# EAGLE schematic Mixer-v1 (EAGLE 6.6.0)

## Sheet 1 of 2
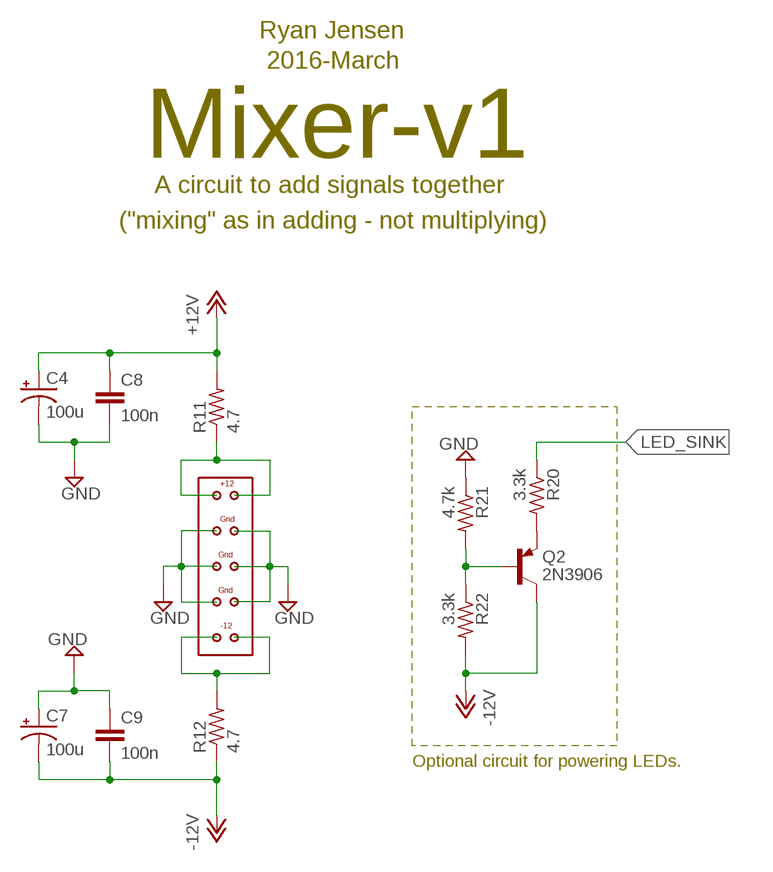
[diagram p0: schematic, sheet 1]

### Parts
C4  100u  CPOL-USE2.5-7  [E2,5-7]
C7  100u  CPOL-USE2.5-7  [E2,5-7]
C8  100n  C-EUC0603  [C0603]
C9  100n  C-EUC0603  [C0603]
Q2  2N3906  [TO92]
R11  4.7  R-US_R0603  [R0603]
R12  4.7  R-US_R0603  [R0603]
R20  3.3k  R-US_R0603  [R0603]
R21  4.7k  R-US_R0603  [R0603]
R22  3.3k  R-US_R0603  [R0603]
U$3  EURORACK-POWER  [EURORACK-POWER]

### Nets
+12V: C4.+ C8.1 R11.2 ; also sheet 2
-12V: C7.- C9.2 Q2.1(C) R12.1 R22.2 ; also sheet 2
GND: C4.- C7.+ C8.2 C9.1 R21.1 U$3.P$3 U$3.P$4 U$3.P$5 U$3.P$6 U$3.P$7 U$3.P$8 ; also sheet 2
LED_SINK: R20.1
N$2: R12.2 U$3.P$9 U$3.P$10
N$5: R11.1 U$3.P$1 U$3.P$2
N$13: Q2.3(E) R20.2
N$15: Q2.2(B) R21.2 R22.1

### Notes on the sheet
- Ryan Jensen
- 2016-March
- Mixer-v1
- A circuit to add signals together
- ("mixing" as in adding - not multiplying)
- Optional circuit for powering LEDs.

## Sheet 2 of 2
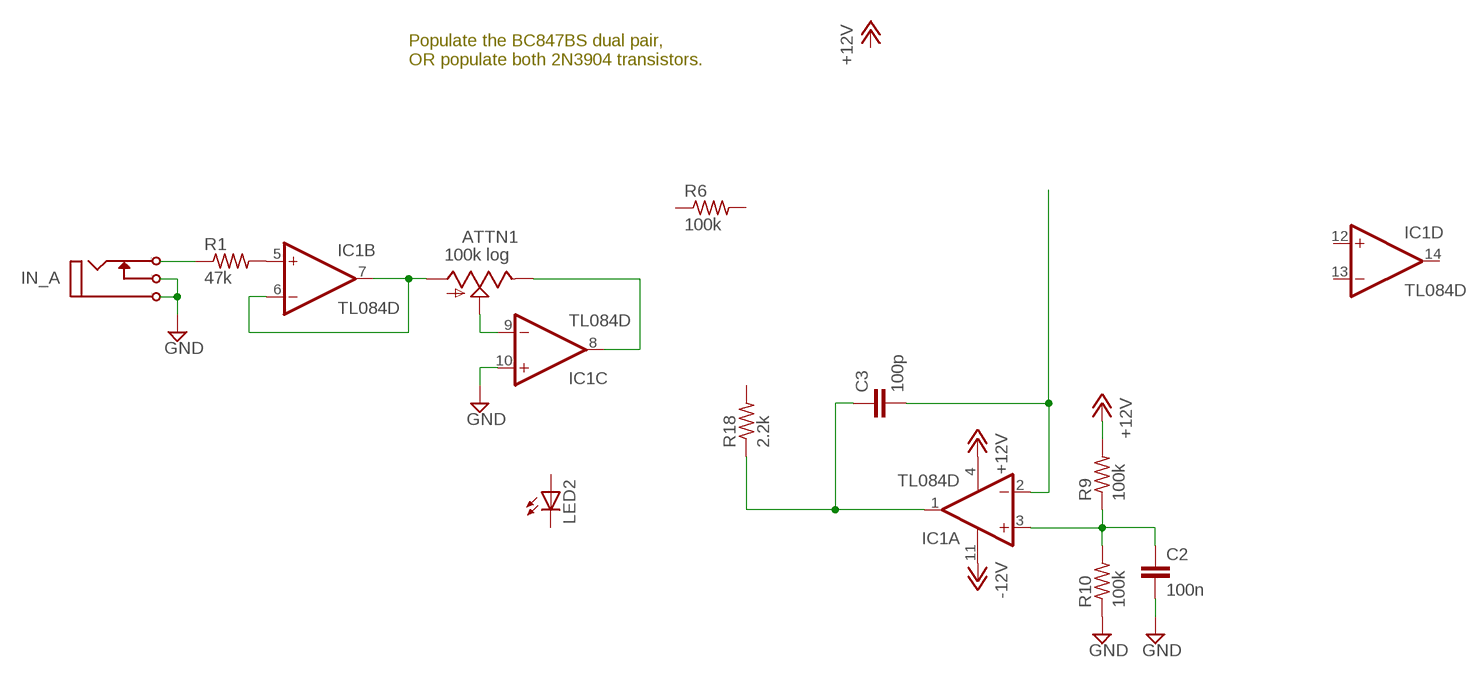
[diagram p1: schematic, sheet 2]

### Parts
ATTN1  100k log  TRIM_US-B64Y  [B64Y]
C2  100n  C-EUC0603  [C0603]
C3  100p  C-EUC0603  [C0603]
IC1  TL084D  [SO14]
IN_A  CV  MONO_JACK  [MONO_JACK]
LED2  LED_ELD260  [LED_LD260]
R1  47k  R-US_R0603  [R0603]
R6  100k  R-US_R0603  [R0603]
R9  100k  R-US_R0603  [R0603]
R10  100k  R-US_R0603  [R0603]
R18  2.2k  R-US_R0603  [R0603]

### Nets
+12V: IC1.4(P:V+) R9.2 ; also sheet 1
-12V: IC1.11(P:V-) ; also sheet 1
GND: C2.2 IC1.10(C:+IN) IN_A.P$1 IN_A.P$3(P3) R10.1 ; also sheet 1
IN_: IN_A.P$2(P2) R1.1
N$1: IC1.5(B:+IN) R1.2
N$3: ATTN1.A IC1.6(B:-IN) IC1.7(B:OUT)
N$4: ATTN1.S IC1.9(C:-IN)
N$6: C2.1 IC1.3(A:+IN) R9.1 R10.2
N$8: ATTN1.E IC1.8(C:OUT)
N$21: C3.1 IC1.1(A:OUT) R18.1
N$22: C3.2 IC1.2(A:-IN)
Unconnected: IC1.12(D:+IN) IC1.13(D:-IN) IC1.14(D:OUT) LED2.A LED2.K(C) R6.1 R6.2 R18.2

### Notes on the sheet
- Populate the BC847BS dual pair,
  OR populate both 2N3904 transistors.

## Library data of the parts
ATTN1 = pot:TRIM_US-: POTENTIOMETER
C2 C3 C8 C9 = rcl:C-EU: CAPACITOR, European symbol
C4 C7 = rcl:CPOL-US: POLARIZED CAPACITOR, American symbol
IC1 = linear:TL084: OP AMP
IN_A = !synth_sch:MONO_JACK; VALUE: I/O
LED2 = eagle-ltspice:LED_E: LED Source: http://www.osram.convergy.de Source: www.luxeon.com Source: www.kingbright.com; SPICEMODEL: NONE; SPICEPREFIX: D; SPICETYPE: diode
Q2 = transistor-pnp:2N3906: PNP Transistor
R1 R6 R9-R12 R18 R20-R22 = rcl:R-US_: RESISTOR, American symbol
U$3 = !synth_sch:EURORACK-POWER